# EAGLE design programmer-board-top (EAGLE 9.6.2)
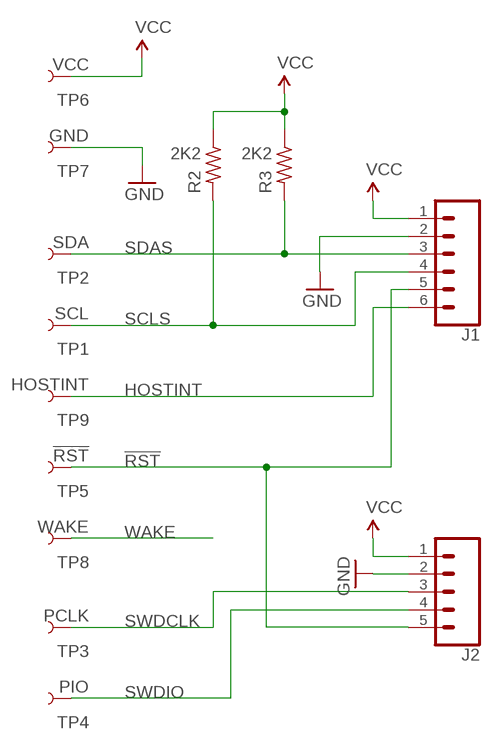
[diagram p0: schematic, sheet 1]

## Parts
J1  CONN_06NO_SILK_FEMALE_PTH  [1X06_NO_SILK]
J2  CONN_05NO_SILK  [1X05_NO_SILK]
R2  2K2  R-US_  [R0402_B]
R3  2K2  R-US_  [R0402_B]
TP1  SCL  TEST-POINT3X6  [PAD.03X.06]
TP2  SDA  TEST-POINT3X6  [PAD.03X.06]
TP3  PCLK  TEST-POINT3X6  [PAD.03X.06]
TP4  PIO  TEST-POINT3X6  [PAD.03X.06]
TP5  !RST  TEST-POINT3X6  [PAD.03X.06]
TP6  VCC  TEST-POINT3X6  [PAD.03X.06]
TP7  GND  TEST-POINT3X6  [PAD.03X.06]
TP8  WAKE  TEST-POINT3X6  [PAD.03X.06]
TP9  HOSTINT  TEST-POINT3X6  [PAD.03X.06]

## Nets
!RST: J1.5 J2.5 TP5.1
GND: J1.2 J2.2 TP7.1
HOSTINT: J1.6 TP9.1
SCLS: J1.4 R2.2 TP1.1
SDAS: J1.3 R3.2 TP2.1
SWDCLK: J2.3 TP3.1
SWDIO: J2.4 TP4.1
VCC: J1.1 J2.1 R2.1 R3.1 TP6.1
WAKE: TP8.1

## Library data of the parts
J1 = SparkFun-Connectors:CONN_06: Multi connection point. Often used as Generic Header-pin footprint for 0.1 inch spaced/style header connections On any of the 0.1 inch spaced packages, you can populate with these: Break Away Headers - Straight <https://www.sparkfun.com/products/116> (PRT-00116) Break Away Male Headers - Right Angle <https://www.sparkfun.com/products/553> (PRT-00553) Female Headers <https://www.sparkfun.com/products/115> (PRT-00115) Break Away Headers - Machine Pin <https://www.sparkfun.com/products/117> (PRT-00117) Break Away Female Headers - Swiss Machine Pin <https://www.sparkfun.com/products/743> (PRT-00743) Arduino Stackable Header - 6 Pin <https://www.sparkfun.com/products/9280> (PRT-09280) For SCREWTERMINALS and SPRING TERMINALS visit here: Screw Terimnals on SparkFun.com <https://www.sparkfun.com/search/results?term=Screw+Terminals> (5mm/3.5mm/2.54mm spacing) This device is also useful as a general connection point to wire up your design to another part of your project. Our various solder wires solder well into these plated through hole pads. Hook-Up Wire - Assortment (Stranded, 22 AWG) <https://www.sparkfun.com/products/11375> (PRT-11375) Hook-Up Wire - Assortment (Solid Core, 22 AWG) <https://www.sparkfun.com/products/11367> (PRT-11367) View the entire wire category on our website here <https://www.sparkfun.com/categories/141>; PROD_ID: CONN-08437
J2 = SparkFun-Connectors:CONN_05: Multi connection point. Often used as Generic Header-pin footprint for 0.1 inch spaced/style header connections On any of the 0.1 inch spaced packages, you can populate with these: Break Away Headers - Straight <https://www.sparkfun.com/products/116> (PRT-00116) Break Away Male Headers - Right Angle <https://www.sparkfun.com/products/553> (PRT-00553) Female Headers <https://www.sparkfun.com/products/115> (PRT-00115) Break Away Headers - Machine Pin <https://www.sparkfun.com/products/117> (PRT-00117) Break Away Female Headers - Swiss Machine Pin <https://www.sparkfun.com/products/743> (PRT-00743) For SCREWTERMINALS and SPRING TERMINALS visit here: Screw Terimnals on SparkFun.com <https://www.sparkfun.com/search/results?term=Screw+Terminals> (5mm/3.5mm/2.54mm spacing) This device is also useful as a general connection point to wire up your design to another part of your project. Our various solder wires solder well into these plated through hole pads. Hook-Up Wire - Assortment (Stranded, 22 AWG) <https://www.sparkfun.com/products/11375> (PRT-11375) Hook-Up Wire - Assortment (Solid Core, 22 AWG) <https://www.sparkfun.com/products/11367> (PRT-11367) View the entire wire category on our website here <https://www.sparkfun.com/categories/141> Special notes: Molex polarized connector foot print use with SKU : PRT-08231 with associated crimp pins and housings. 1MM SMD Version SKU: PRT-10208
R2 R3 = Spark:R-US_: 0402 Resistor
TP1-TP9 = test-pad:TEST-POINT: SparkFun Test Points Bare copper test points for troubleshooting or In-Circuit-Testing. These are used by our Production team for verifying production board runs using pogo-pins on test beds. SparkFun Products: SparkFun LSM9DS1 Breakout <https://www.sparkfun.com/products/13284> SparkFun PSOC <https://www.sparkfun.com/products/13714> SparkFun Load Cell Amplifier <https://www.sparkfun.com/products/13879>

## Board
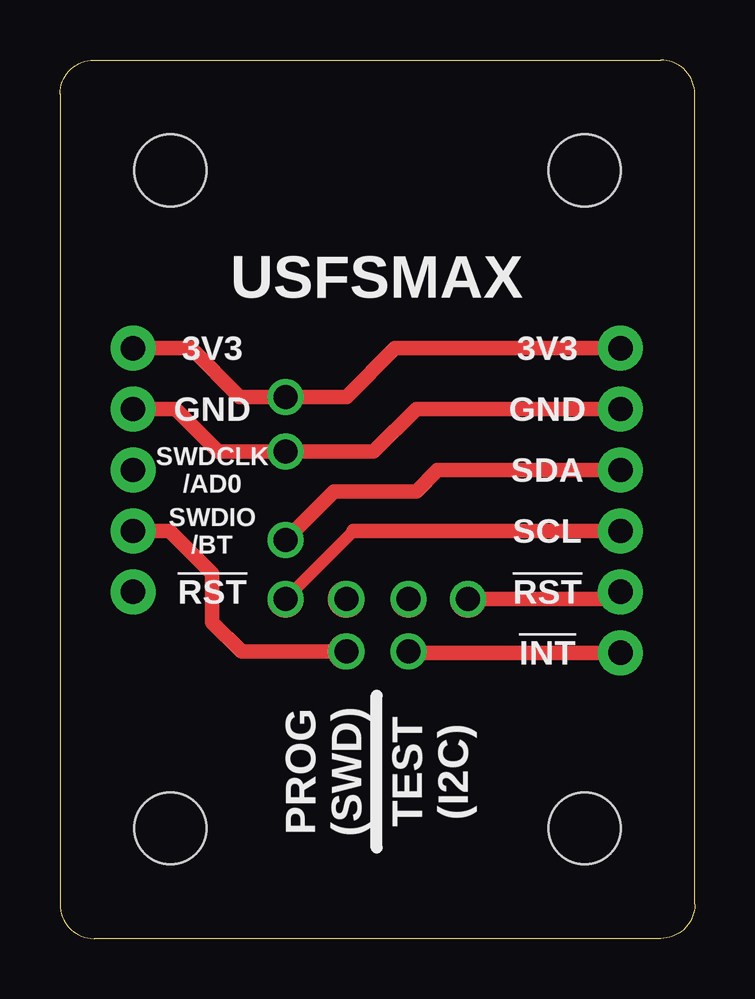
[diagram p1: board, top side]
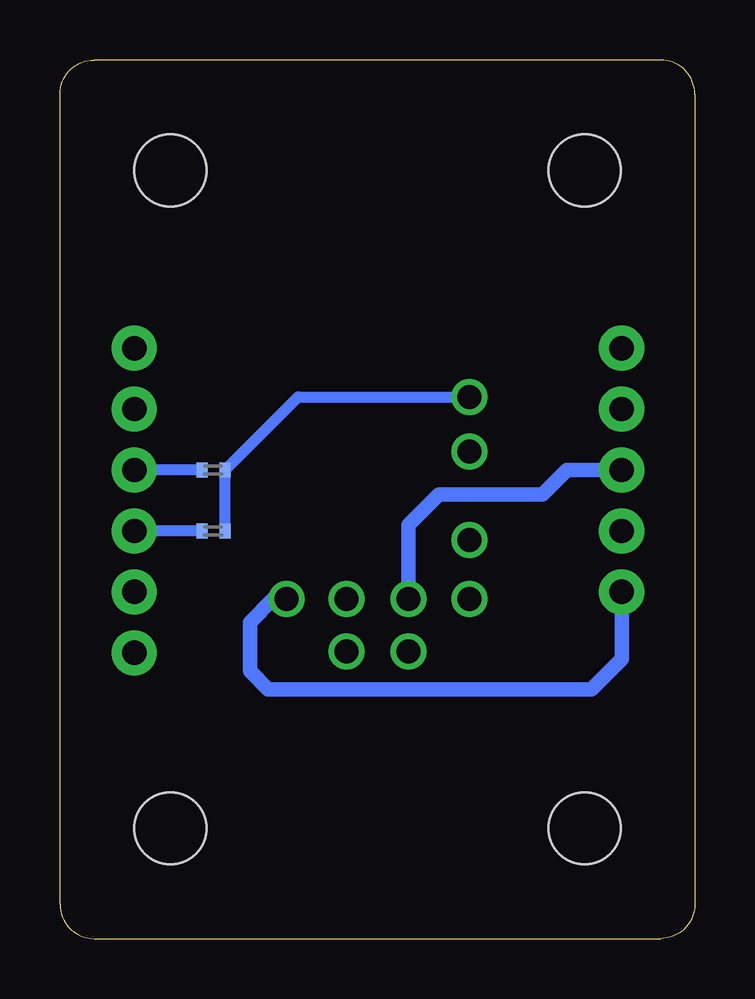
[diagram p2: board, bottom side, seen from below]

Size 26.47 x 36.63 mm. Coordinates in mm from the lower left corner, seen from the top.
Outline: 1.42,36.63 25.04,36.63 arc-90 26.47,35.2 26.47,1.42 arc-90 25.04,0 1.42,0 arc-90 0,1.42 0,35.2 arc-90 1.42,36.63
Copper layers (1*16): Top 0.035559375mm / dielectric 1.6mm / Bottom 0.035559375mm
Design rules "oshpark-2layer": minimum track width 6mil, minimum drill 10mil, track to track 6mil, track to pad 6mil, pad to pad 6mil, via to via 6mil, smd to smd 6mil, copper to edge 15mil, drill to drill 6mil, minimum pad ring 5mil, minimum via ring 5mil, stop-mask expansion 2.5mil, vias tented up to drill 0mil, thermal gap 10mil
Holes 3 mm at 4.6,32.03 21.87,32.03 21.87,4.6 4.6,4.6

### Footprints (pad centres in the part's own frame; a part is rotated, then mirrored left to right if it is on the bottom)
1X06_NO_SILK = drill 1.016 pad 1.88: 1 0,0; 2 2.54,0; 3 5.08,0; 4 7.62,0; 5 10.16,0; 6 12.7,0
1X05_NO_SILK = drill 1.016 pad 1.88: 1 0,0; 2 2.54,0; 3 5.08,0; 4 7.62,0; 5 10.16,0
R0402_B = smd 0.457 x 0.61: 1 -0.483,0; 2 0.483,0
PAD.03X.06 = smd 1.524 x 1.524: 1 0,0

### Placement (x,y rotation side)
J1  23.37,24.61 270 top
J2  3.05,24.61 270 top
R2  20.07,16.99 180 bottom
R3  20.07,19.53 180 bottom
TP1  9.4,14.15 0 top
TP2  9.4,16.61 0 top
TP3  11.94,14.15 0 top
TP4  11.94,11.96 0 top
TP5  17.02,14.15 0 top
TP6  9.4,22.58 0 top
TP7  9.4,20.29 0 top
TP8  14.53,14.15 0 top
TP9  14.53,11.96 0 top

### Tracks (layer width: path | path; a pad name or v marks a point on that pad's centre or on a via)
!RST  (via drill 1)
  Top 0.61: TP5.1 23.06,14.15 J1.5
  Bottom 0.61: J2.5 3.05,11.66 4.32,10.39 17.78,10.39 18.54,11.15 18.54,13.18 17.58,14.15 TP5.1
  other vias: 17.02,14.15
GND  (via drill 1)
  Top 0.61: J1.2 14.86,22.07 13.08,20.29 TP7.1 6.6,20.29 4.83,22.07 J2.2
  other vias: 9.4,20.29
HOSTINT  (via drill 1)
  Top 0.61: TP9.1 14.58,11.91 J1.6
  other vias: 14.53,11.96
SCLS  (via drill 1)
  Top 0.508: TP1.1 12.24,16.99
  Top 0.61: 12.24,16.99 J1.4
  Bottom 0.457: R2.2 J1.4
  other vias: 9.4,14.15
SDAS  (via drill 1)
  Top 0.61: TP2.1 11.43,18.64 14.86,18.64 15.75,19.53 J1.3
  Bottom 0.457: R3.2 J1.3
  other vias: 9.4,16.61
SWDCLK  (via drill 1)
  Bottom 0.61: TP3.1 11.94,17.25 10.67,18.52 6.35,18.52 5.33,19.53 J2.3
  other vias: 11.94,14.15
SWDIO  (via drill 1)
  Top 0.61: J2.4 4.57,16.99 6.35,15.21 6.35,13.18 7.57,11.96 TP4.1
  other vias: 11.94,11.96
VCC  (via drill 1)
  Top 0.61: J1.1 13.97,24.61 11.94,22.58 TP6.1 7.49,22.58 5.46,24.61 J2.1
  Bottom 0.457: R2.1 R3.1 16.54,22.58 TP6.1
  other vias: 9.4,22.58
WAKE  (via drill 1)
  other vias: 14.53,14.15

### Text on the board
tPlace: USFSMAX | 3V3 | 3V3 | GND | GND | SWDCLK / /AD0 | SDA | SWDIO / /BT | SCL | !RST | !RST | !INT | PROG / (SWD) | TEST / (I2C)